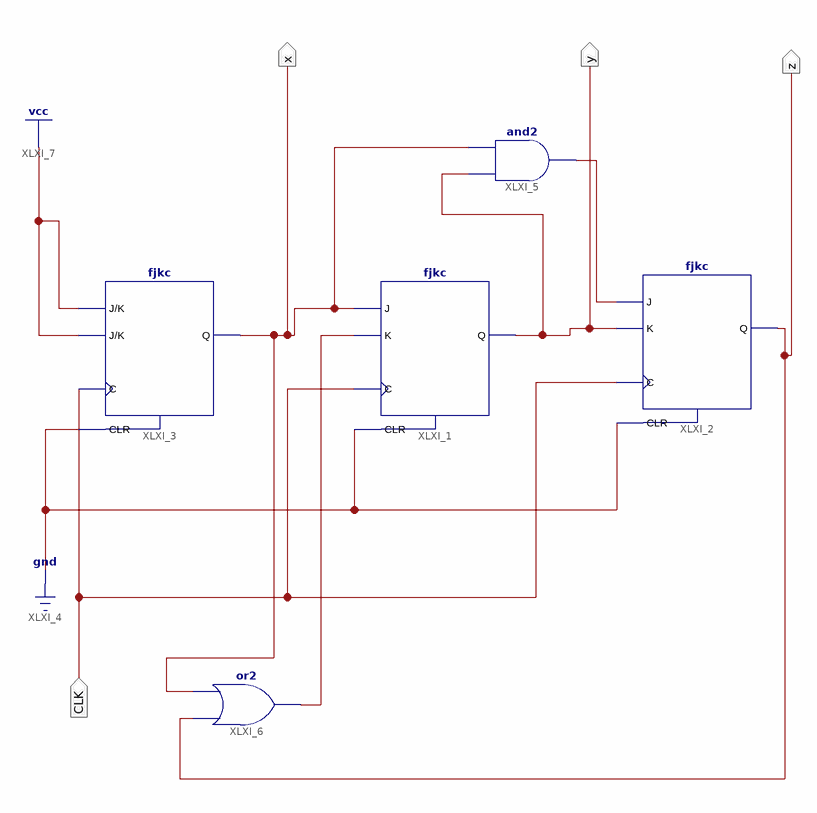
[diagram p0: schematic sheet 1]
// Xilinx ISE schematic ffcount.sch (spartan6) as structural Verilog: 5 symbols, 4 ports
module ffcount (
  input  CLK,
  output y,
  output x,
  output z
);

  wire XLXN_9, XLXN_13;

  fjkc XLXI_1 (.C(CLK), .CLR(1'b0), .J(x), .K(XLXN_9), .Q(y));
  fjkc XLXI_2 (.C(CLK), .CLR(1'b0), .J(XLXN_13), .K(y), .Q(z));
  fjkc XLXI_3 (.C(CLK), .CLR(1'b0), .J(1'b1), .K(1'b1), .Q(x));
  and XLXI_5 (XLXN_13, y, x);
  or XLXI_6 (XLXN_9, z, x);
endmodule
